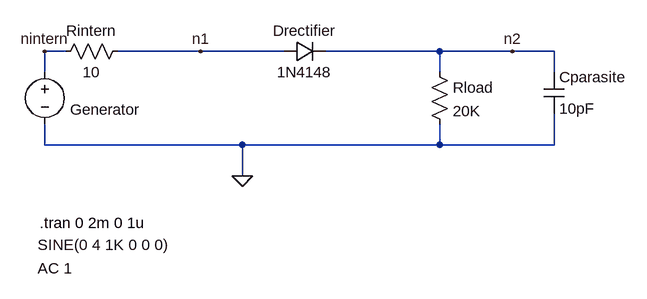
[diagram p0: schematic lab1_prep_3-3_schematic.asc]
lab1_prep_3-3_schematic.asc, the LTspice schematic file:
Version 4
SHEET 1 880 680
WIRE -96 -496 -128 -496
WIRE 112 -496 -16 -496
WIRE 240 -496 112 -496
WIRE 480 -496 304 -496
WIRE 592 -496 480 -496
WIRE 656 -496 592 -496
WIRE -128 -464 -128 -496
WIRE 480 -464 480 -496
WIRE 656 -464 656 -496
WIRE -128 -352 -128 -384
WIRE 176 -352 -128 -352
WIRE 480 -352 480 -384
WIRE 480 -352 176 -352
WIRE 656 -352 656 -400
WIRE 656 -352 480 -352
WIRE 176 -304 176 -352
FLAG 176 -304 0
FLAG 592 -496 n2
FLAG 112 -496 n1
FLAG -128 -496 nintern
SYMBOL res -112 -480 R270
WINDOW 0 32 56 VTop 2
WINDOW 3 0 56 VBottom 2
SYMATTR InstName Rintern
SYMATTR Value 10
SYMBOL diode 240 -480 R270
WINDOW 0 32 32 VTop 2
WINDOW 3 0 32 VBottom 2
SYMATTR InstName Drectifier
SYMATTR Value 1N4148
SYMBOL res 464 -480 R0
SYMATTR InstName Rload
SYMATTR Value 20K
SYMBOL voltage -128 -480 R0
WINDOW 0 39 74 Left 2
WINDOW 3 -11 282 Left 2
WINDOW 123 -11 318 Left 2
WINDOW 39 0 0 Left 0
SYMATTR InstName Generator
SYMATTR Value SINE(0 4 1K 0 0 0)
SYMATTR Value2 AC 1
SYMBOL cap 640 -464 R0
SYMATTR InstName Cparasite
SYMATTR Value 10pF
TEXT -136 -232 Left 2 !.tran 0 2m 0 1u

The netlist it stands for:
* lab1_prep_3-3_schematic.asc
Rintern nintern n1 10
Drectifier n1 n2 1N4148
Rload n2 0 20K
V§Generator nintern 0 SINE(0 4 1K 0 0 0) AC 1
Cparasite n2 0 10pF
.model D D
.lib standard.dio
.tran 0 2m 0 1u
.backanno
.end